# EAGLE design Review_PCD_1.1 (EAGLE 9.6.2)
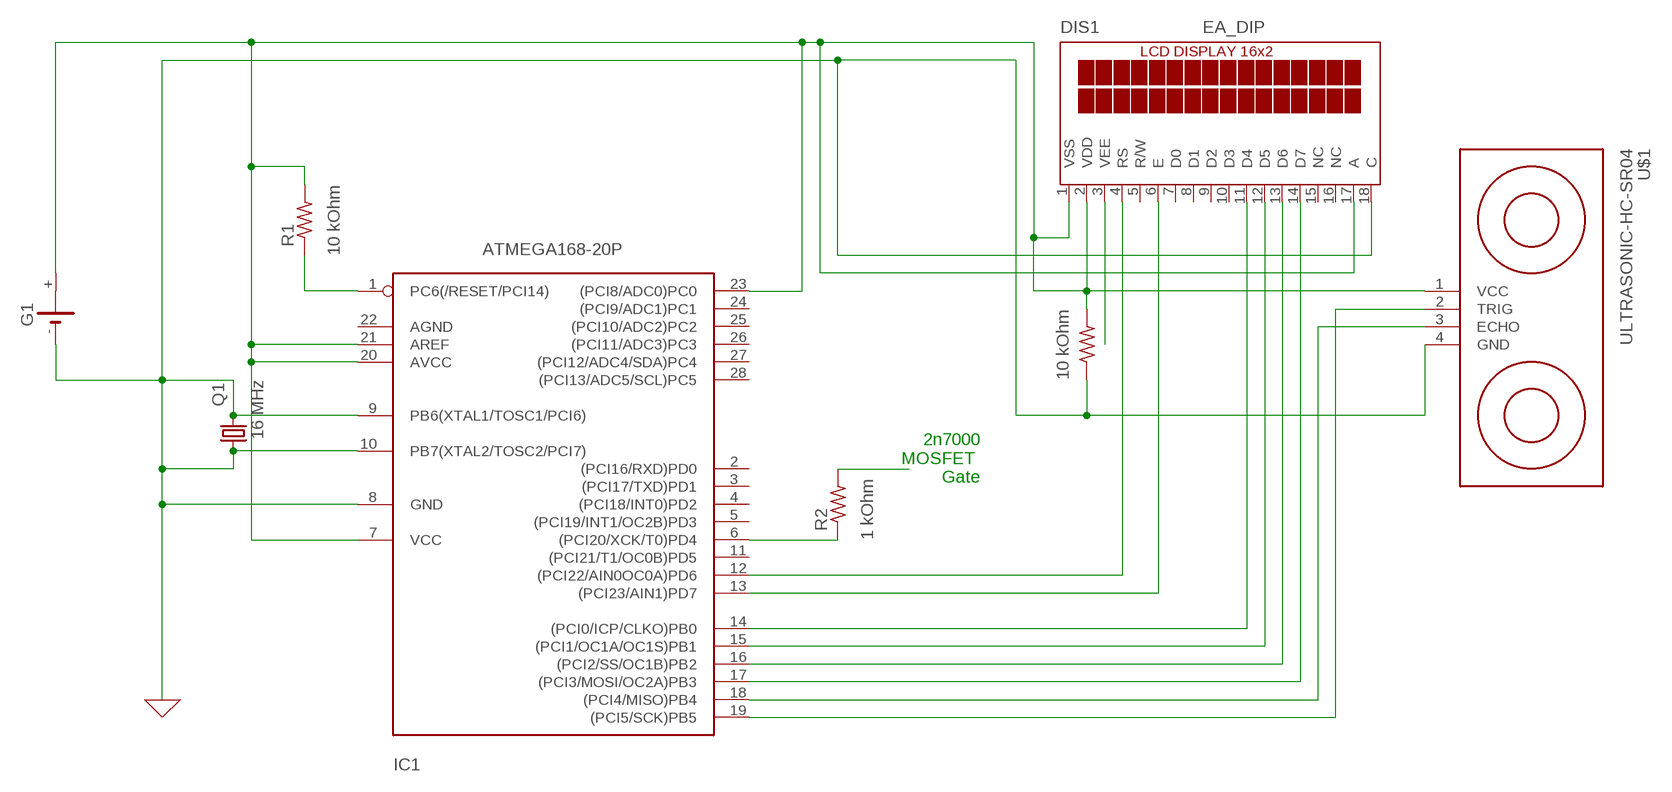
[diagram p0: schematic, sheet 1]

## Parts
DIS1  EA_DIP  [EA_DIP]
G1  CR1/2  [CR1/2]
IC1  ATMEGA168-20P  [DIL28-3]
Q1  KX-4  [1.6X1.2]
R1  R-US_R2012W  [R2012W]
R2  R-US_R2012W  [R2012W]
R3  R-US_R2012W  [R2012W]
U$1  ULTRASONIC-HC-SR04  [ULTRASONIC-HC-SR04]

## Nets
0: DIS1.18(C) G1.- IC1.8(GND) IC1.9(PB6(XTAL1/TOSC1/PCI6)) IC1.10(PB7(XTAL2/TOSC2/PCI7)) Q1.1 Q1.3 R3.1 U$1.4(GND) ; supply symbol labelled GND
N$1: DIS1.1(VSS) DIS1.2(VDD) DIS1.17(A) G1.+ IC1.7(VCC) IC1.20(AVCC) IC1.21(AREF) IC1.23((PCI8/ADC0)PC0) R1.2 R3.2 U$1.1(VCC)
N$2: IC1.1(PC6(/RESET/PCI14)) R1.1
N$3: IC1.6((PCI20/XCK/T0)PD4) R2.1
N$4: R2.2
N$5: DIS1.4(RS) IC1.12((PCI22/AIN0OC0A)PD6)
N$6: DIS1.6(E) IC1.13((PCI23/AIN1)PD7)
N$7: DIS1.11(D4) IC1.14((PCI0/ICP/CLKO)PB0)
N$8: DIS1.12(D5) IC1.15((PCI1/OC1A/OC1S)PB1)
N$9: DIS1.13(D6) IC1.16((PCI2/SS/OC1B)PB2)
N$10: DIS1.14(D7) IC1.17((PCI3/MOSI/OC2A)PB3)
N$12: IC1.18((PCI4/MISO)PB4) U$1.3(ECHO)
N$13: DIS1.3(VEE)
N$14: IC1.19((PCI5/SCK)PB5) U$1.2(TRIG)
Unconnected: DIS1.5(R/W) DIS1.7(D0) DIS1.8(D1) DIS1.9(D2) DIS1.10(D3) DIS1.15(NC) DIS1.16(NC) G1.+@1(+) IC1.2((PCI16/RXD)PD0) IC1.3((PCI17/TXD)PD1) IC1.4((PCI18/INT0)PD2) IC1.5((PCI19/INT1/OC2B)PD3) IC1.11((PCI21/T1/OC0B)PD5) IC1.22(AGND) IC1.24((PCI9/ADC1)PC1) IC1.25((PCI10/ADC2)PC2) IC1.26((PCI11/ADC3)PC3) IC1.27((PCI12/ADC4/SDA)PC4) IC1.28((PCI13/ADC5/SCL)PC5)

## Notes on the sheet
- 2n7000
  MOSFET 
  Gate

## Library data of the parts
DIS1 = display-lcd:EA_DIP: LCD-MODUL 2x16 - 6,68mm, INKL. KONTROLLER HD44780 Source: Data sheet <http://www.lcd-module.de/pdf/doma/dip162-d.pdf>
G1 = battery:CR1/2: LI BATTERY Sonnenschein SL-350 PT
IC1 = adafruit:ATMEGA168*P: MICROCONTROLLER 16 kBytes FLASH 1 kBytes SRAM 512 Bytes EEPROM USART 8-channel 10 bit ADC
Q1 = crystal-geyer_V1_0:KX: Quartz Crystals (MHz) SMD: KX - Serie Model Size l/w/h [mm] Frequency Range Frequency Stability Temp. Range [°C] Load Capacitance AECQ 200 availabel Datasheet KX-4 KX-5 KX-6 KX-7 KX-9A KX-9B KX-12A KX-12B KX-13 KX-20 KX-K KX-KS 1.6/1.2/0.3 2.0/1.6/0.45 2.5/2.0/0.55 3.2/2.5/0.8 5.0/3.2/1.0 5.0/3.2/1.1 6.0/3.5/1.1 6.0/3.5/1.0 7.0/5.0 /1.3 11.6/5.5/1.6 12.3/4.5/4.2 12.3/4.5/3.2 24.0 ~ 80.0 MHz 16.0 ~ 80.0 MHz 12.0 ~ 80.0 MHz 8.0 ~ 60.0 MHz 7,68 ~ 300,0 MHz 8,0 ~ 50,0 MHz 8,0 ~ 150,0 MHz 8,0 ~ 50,0 MHz 6,0 ~ 160,0 MHz 3,579 ~ 25,0 MHz 3,579 ~ 70,0 MHz 3,579 ~ 70,0 MHz ±10 … ±50ppm ±10 … ±50ppm ±10 … ±50ppm ±10 … ±50ppm ±10 … ±50ppm ±10 … ±50ppm ±10 … ±50ppm ±10 … ±50ppm ±10 … ±50ppm ±50ppm ±10 … ±50ppm ±10 … ±50ppm (*) -40°C …+85°C (*) -40°C …+125°C (*) -40°C …+125°C (*) -40°C …+125°C (*) -40°C …+105°C (*) -40°C …+105°C (*) -40°C …+125°C (*) -40°C …+105°C (*) -40°C …+105°C (*) -40°C …+105°C (*) -40°C …+85°C (*) -40°C …+85°C 8, 8…16 8, 8…16 10, 8…16 12, 7…20 16, 10…20 16, 10…20 16, 10…20 16, 12…20 16, 12…20 16, 12…20 16, 12…30 16, 12…30 - yes yes yes - - - - - - - - KX-4.pdf <http://www.geyer-electronic.de/uploads/tx_userartikelfrequenz/GEYER-KX-4.pdf> KX-5.pdf <http://www.geyer-electronic.de/uploads/tx_userartikelfrequenz/GEYER-KX-5.pdf> KX-6.pdf <http://www.geyer-electronic.de/uploads/tx_userartikelfrequenz/GEYER-KX-6.pdf> KX-7.pdf <http://www.geyer-electronic.de/uploads/tx_userartikelfrequenz/GEYER-KX-7.pdf> KX-9A.pdf <http://www.geyer-electronic.de/uploads/tx_userartikelfrequenz/GEYER-KX-9A.pdf> KX-9B.pdf <http://www.geyer-electronic.de/uploads/tx_userartikelfrequenz/GEYER-KX-9B.pdf> KX-12A.pdf <http://www.geyer-electronic.de/uploads/tx_userartikelfrequenz/GEYER-KX-12A.pdf> KX-12B.pdf <http://www.geyer-electronic.de/uploads/tx_userartikelfrequenz/GEYER-KX-12B.pdf> KX-13.pdf <http://www.geyer-electronic.de/uploads/tx_userartikelfrequenz/GEYER-KX-13.pdf> KX-20.pdf <http://www.geyer-electronic.de/uploads/tx_userartikelfrequenz/GEYER-KX-20.pdf> KX-K.pdf <http://www.geyer-electronic.de/uploads/tx_userartikelfrequenz/GEYER-KX-K.pdf> KX-KS.pdf <http://www.geyer-electronic.de/uploads/tx_userartikelfrequenz/GEYER-KX-KS.pdf> <http://www.geyer-electronic.de/fileadmin/template/img/logo-geyer-electronic.png> Details see: http://www.geyer-electronic.de/Frequenz-Produkte.9.0.html Created 2016-06-07, Hans Locher 2016 (C) Geyer Quartz Technology KX4,KX5,KX6,KX7,KX9A,KX9B,KX12A,KX12B,KX13,KX20,KXK,KXKS;1612;2016;2520;3225;5032;6035;7050;11655;12345;1,6x1,2;2,0x1,6;2,5x2,0;3,2x2,5;5,0x3,2;6,0x3,5;7,0x5,0;11,6x5,5;12,3x4,5;12,3x4,5;1.6x1.2;2.0x1.6;2.5x2.0;3.2x2.5;5.0x3.2;6.0x3.5;7.0x5.0;11.6x5.5;12.3x4.5;12.3x4.5;; Q1: 16 MHz
R1 R3 = adafruit:R-US_: RESISTOR, American symbol; R1: 10 kOhm
R2 = adafruit:R-US_: RESISTOR, American symbol; R1: 1 kOhm
U$1 = diy-modules:ULTRASONIC-HC-SR04: Ultrasonic Ranging Module HC-SR04 More details available here: http://randomnerdtutorials.com/complete-guide-for-ultrasonic-sensor-hc-sr04/ Click here to find device on ebay.com <http://www.ebay.com/sch/hc+sr04+ultrasonic>

## Board
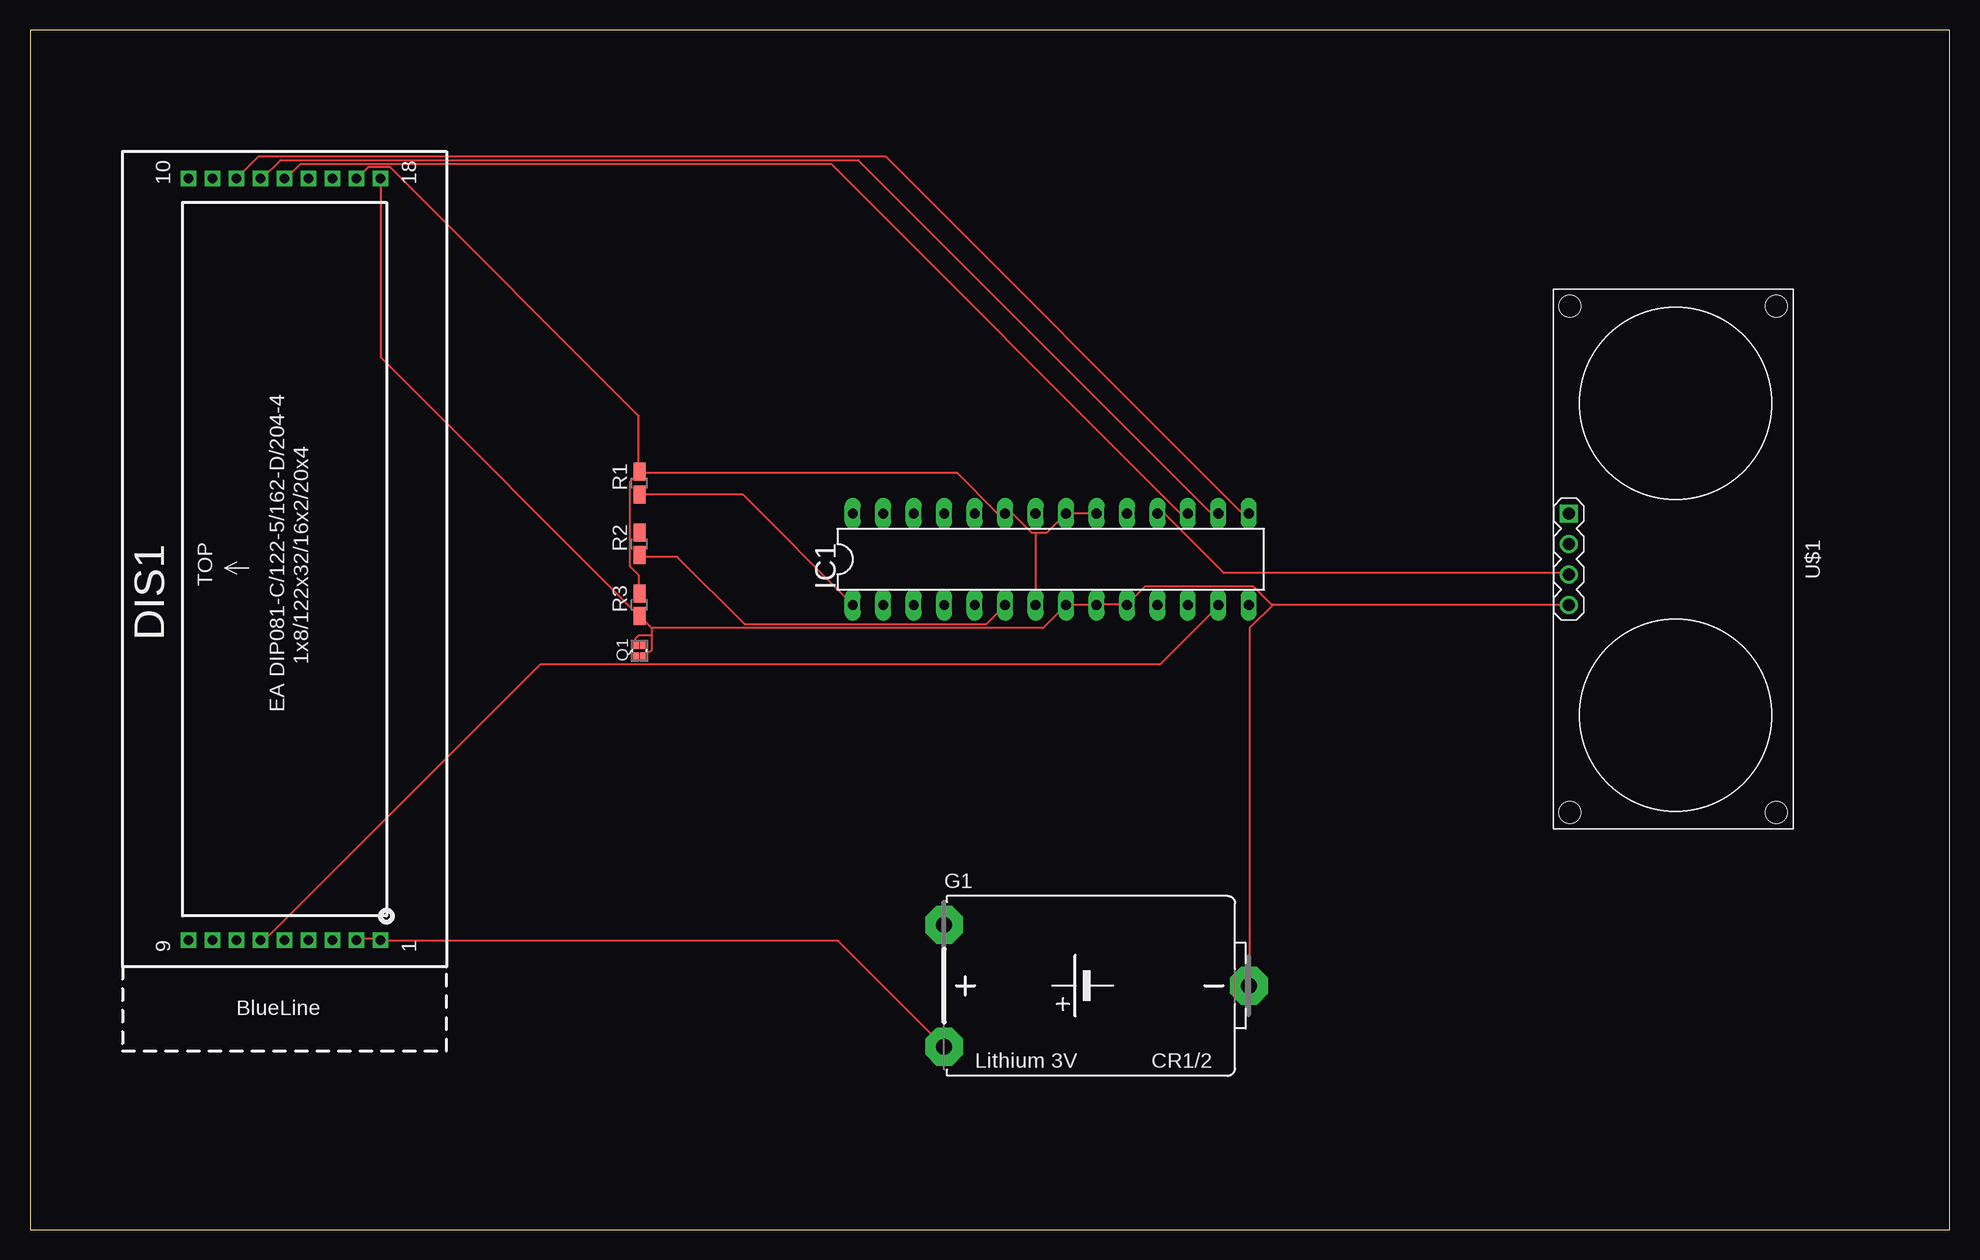
[diagram p1: board, top side]
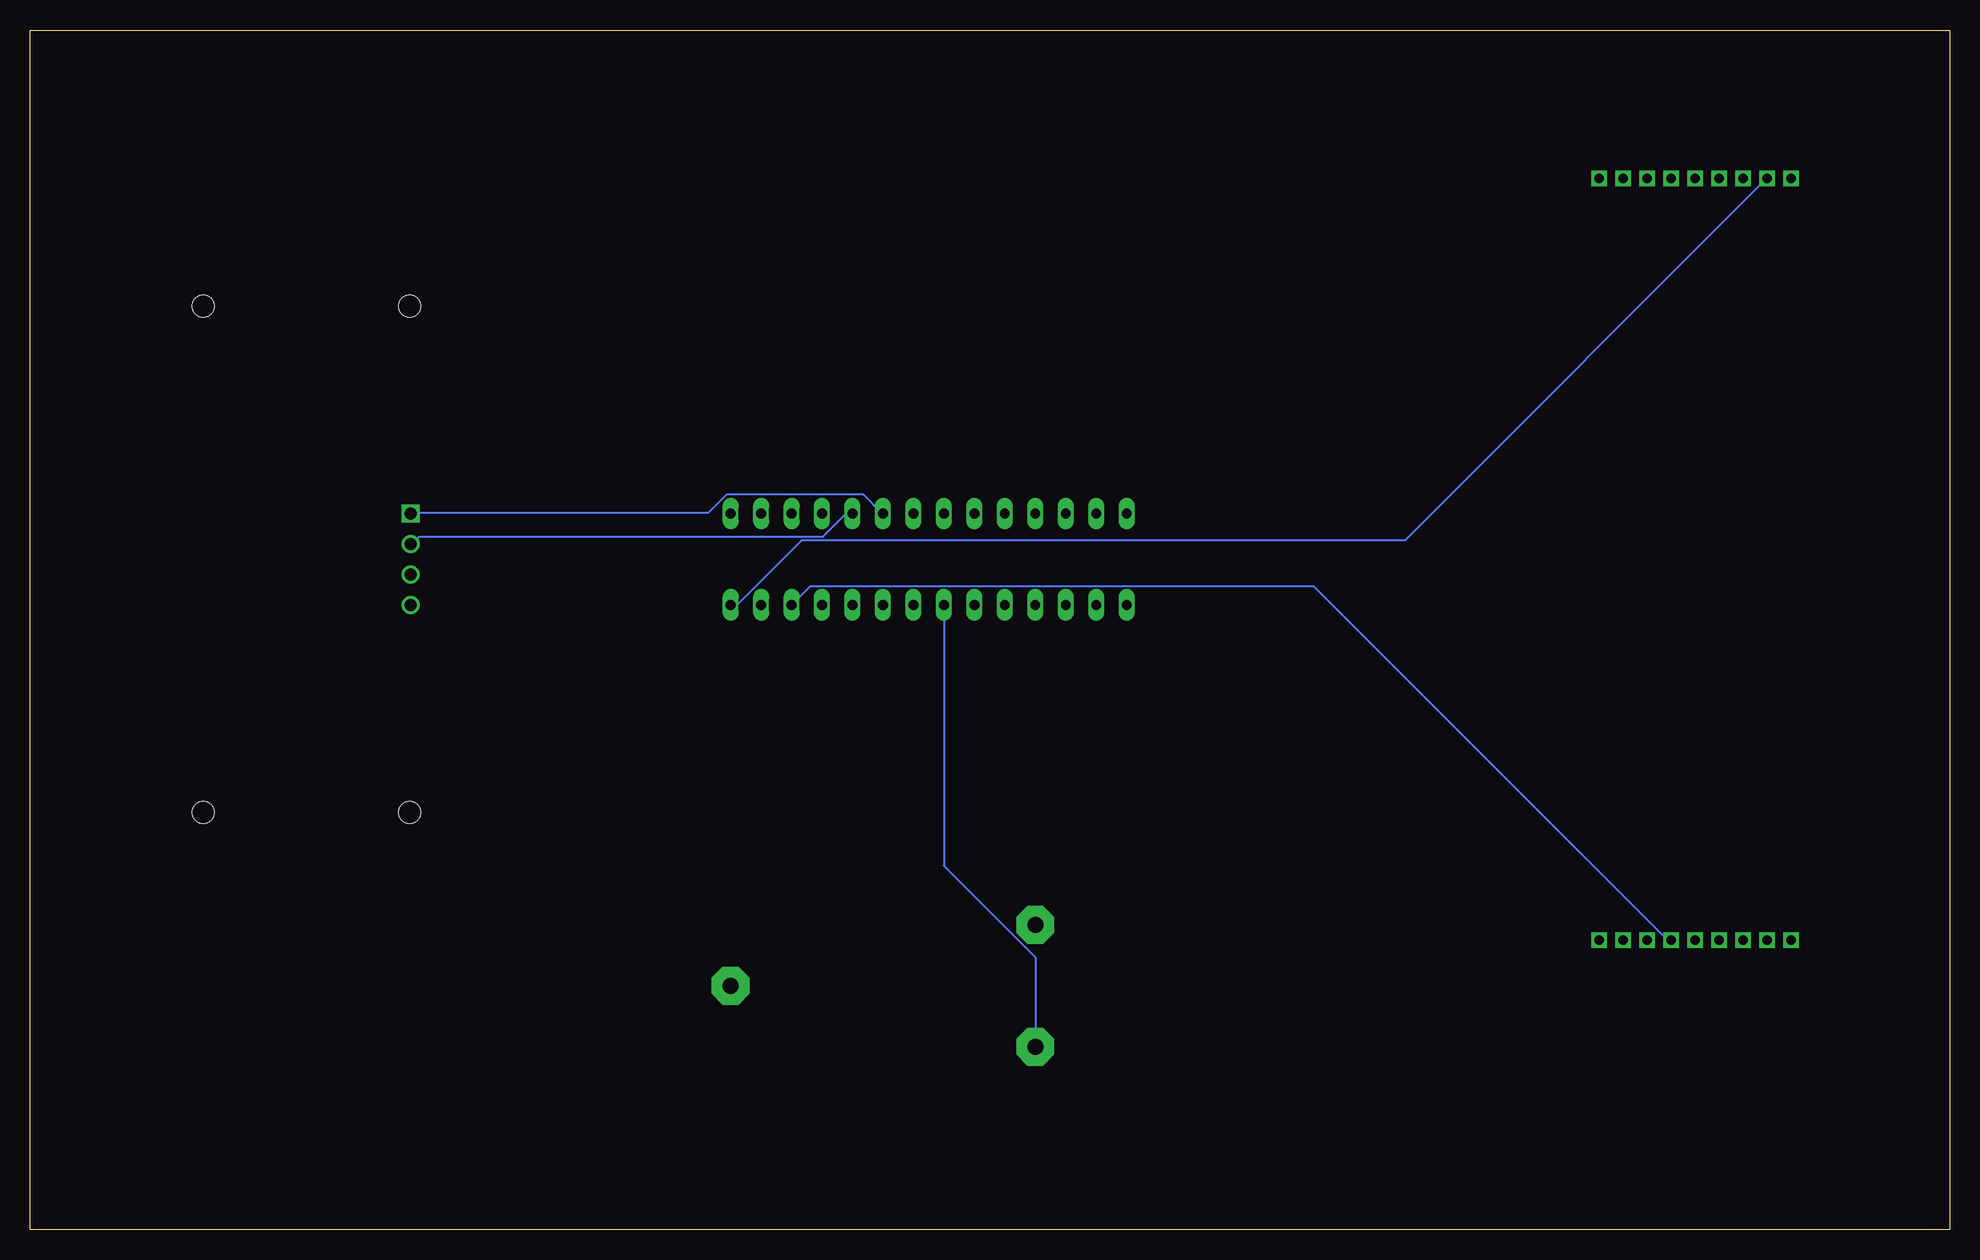
[diagram p2: board, bottom side, seen from below]

Size 160 x 100 mm. Coordinates in mm from the lower left corner, seen from the top.
Outline: 0,0 160,0 160,100 0,100 0,0
Copper layers (1*16): Top 0.035mm / dielectric 0.15mm / Bottom 0.035mm
Design rules "default": minimum track width 6mil, minimum drill 0.35mm, track to track 6mil, track to pad 6mil, pad to pad 6mil, via to via 6mil, smd to smd 6mil, copper to edge 40mil, drill to drill 6mil, minimum pad ring 10mil, minimum via ring 8mil, stop-mask expansion 4mil, vias tented up to drill 0mil, thermal gap 10mil

### Footprints (pad centres in the part's own frame; a part is rotated, then mirrored left to right if it is on the bottom)
EA_DIP = drill 0.813 pad 1.27 square: 1 0,0; 2 0,2; 3 0,4; 4 0,6; 5 0,8; 6 0,10; 7 0,12; 8 0,14; 9 0,16; 10 63.5,16; 11 63.5,14; 12 63.5,12; 13 63.5,10; 14 63.5,8; 15 63.5,6; 16 63.5,4; 17 63.5,2; 18 63.5,0
CR1/2 = drill 1.321 pad 3.15 octagon: + -12.7,-5.08; +@1 -12.7,5.08; - 12.7,0
DIL28-3 = drill 0.813 long: 1 -16.51,-3.81; 2 -13.97,-3.81; 3 -11.43,-3.81; 4 -8.89,-3.81; 5 -6.35,-3.81; 6 -3.81,-3.81; 7 -1.27,-3.81; 8 1.27,-3.81; 9 3.81,-3.81; 10 6.35,-3.81; 11 8.89,-3.81; 12 11.43,-3.81; 13 13.97,-3.81; 14 16.51,-3.81; 15 16.51,3.81; 16 13.97,3.81; 17 11.43,3.81; 18 8.89,3.81; 19 6.35,3.81; 20 3.81,3.81; 21 1.27,3.81; 22 -1.27,3.81; 23 -3.81,3.81; 24 -6.35,3.81; 25 -8.89,3.81; 26 -11.43,3.81; 27 -13.97,3.81; 28 -16.51,3.81
1.6X1.2 = smd 0.75 x 0.65: 1 -0.525,-0.375; 2 0.525,-0.375; 3 0.525,0.375; 4 -0.525,0.375
R2012W = smd 1.5 x 1: 1 -0.94,0; 2 0.94,0
ULTRASONIC-HC-SR04 = drill 1 square: 1 -3.81,-8.89 | drill 1: 2 -1.27,-8.89; 3 1.27,-8.89; 4 3.81,-8.89 | hole 1.8: -21.1,8.4; -21.1,-8.8; 21.1,-8.8; 21.1,8.4

### Placement (x,y rotation side)
DIS1  29.21,24.13 90 top
G1  88.9,20.32 0 top
IC1  85.09,55.88 0 top
Q1  50.8,48.26 90 top
R1  50.8,62.23 90 top
R2  50.8,57.15 90 top
R3  50.8,52.07 90 top
U$1  137.16,55.88 270 top

### Tracks (layer width: path | path; a pad name or v marks a point on that pad's centre or on a via)
0
  Top 0.152: 91.44,52.12 89,52.12 IC1.9 88.85,52.12 86.41,52.12 IC1.8 84.43,50.14 51.82,50.14 | 103.63,52.12 103.48,52.12 101.96,53.65 92.96,53.65 91.44,52.12 | 103.63,52.12 128.17,52.12 U$1.4 | 91.44,52.12 IC1.10 | 103.63,52.12 101.65,50.14 101.65,20.42 G1.- | 51.82,50.14 51.82,49.53 | 51.82,49.53 51.82,48.31 51.66,48.16 51.51,48.16 51.21,47.85 Q1.1 | 51.82,50.14 50.9,51.05 R3.1 50.75,51.21 29.26,72.69 29.26,87.63 DIS1.18 | 51.82,49.53 50.75,49.53 50.44,49.23 50.44,48.92 Q1.3
N$1
  Top 0.152: DIS1.2 27.28,24.23 29.11,24.23 DIS1.1 29.26,24.08 67.36,24.08 G1.+ | 83.82,58.06 84.73,58.06 IC1.21 86.41,59.74 88.85,59.74 IC1.20 | 83.82,58.06 83.52,58.06 81.99,59.59 81.38,59.59 IC1.23 81.23,59.74 80.62,59.74 77.27,63.09 50.9,63.09 R1.2 | 83.82,58.06 IC1.7 | R3.2 50.75,53.03 50.75,54.56 49.99,55.32 49.99,62.33 50.75,63.09 R1.2 | DIS1.17 27.28,87.63 28.19,88.54 30.02,88.54 50.75,67.82 50.75,63.25 R1.2
  Bottom 0.152: U$1.1 128.17,59.74 103.48,59.74 101.96,61.27 90.53,61.27 89,59.74 IC1.20 | G1.+ 76.2,22.71 83.82,30.33 IC1.7
N$2
  Top 0.152: R1.1 50.9,61.27 59.44,61.27 68.58,52.12 IC1.1
N$3
  Top 0.152: R2.1 50.9,56.08 53.95,56.08 59.59,50.44 79.7,50.44 81.23,51.97 IC1.6
N$5
  Bottom 0.152: IC1.12 94.94,53.65 53.03,53.65 23.62,24.23 23.32,24.23 DIS1.4
N$6
  Top 0.152: DIS1.6 19.36,24.23 19.66,24.23 42.52,47.09 94.18,47.09 99.06,51.97 IC1.13
N$7
  Bottom 0.152: IC1.14 101.5,52.12 101.04,52.12 95.71,57.45 45.41,57.45 15.24,87.63 DIS1.11
N$8
  Top 0.152: IC1.15 101.5,59.74 101.04,59.74 71.32,89.46 19.05,89.46 DIS1.12
N$9
  Top 0.152: IC1.16 99.06,59.74 98.45,59.74 69.04,89.15 20.88,89.15 19.36,87.63 DIS1.13
N$10
  Top 0.152: IC1.17 96.47,59.74 95.86,59.74 66.75,88.85 22.55,88.85 21.34,87.63 DIS1.14
N$12
  Top 0.152: IC1.18 94.03,59.59 94.64,59.59 99.52,54.71 128.17,54.71 U$1.3
N$14
  Bottom 0.152: IC1.19 91.44,59.59 92.05,59.59 93.88,57.76 127.56,57.76 128.17,57.15 U$1.2